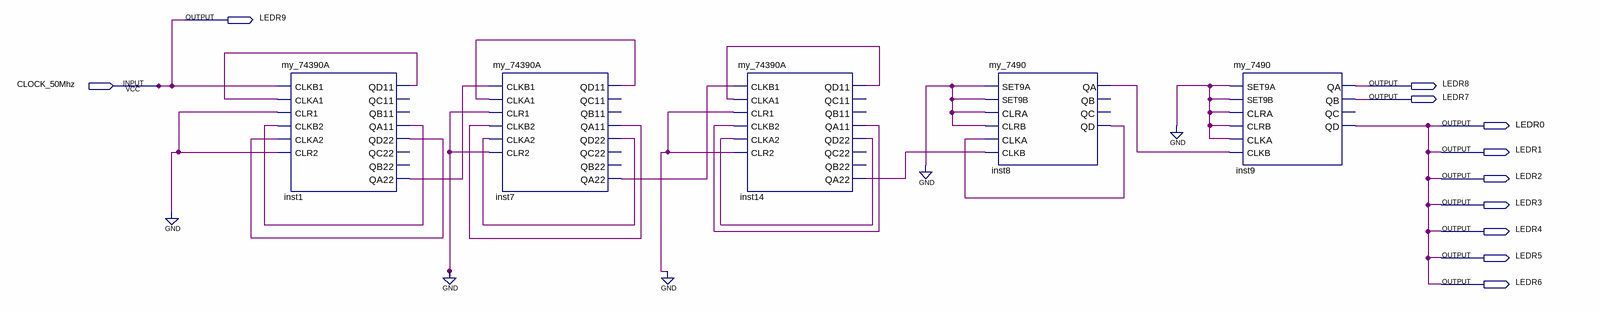
[diagram p0: schematic sheet]
// Quartus schematic DivHorlogemodif.bdf as structural Verilog: 5 symbols, 11 pins
module DivHorlogemodif (
  input  CLOCK_50Mhz,
  output LEDR9,
  output LEDR8,
  output LEDR7,
  output LEDR0,
  output LEDR1,
  output LEDR2,
  output LEDR3,
  output LEDR4,
  output LEDR5,
  output LEDR6
);

  wire inst1_qa11, inst1_qa22, inst1_qd11, inst1_qd22, inst7_qa11, inst7_qa22, inst7_qd11, inst7_qd22,
       inst8_qa, inst8_qd, inst14_qa11, inst14_qa22, inst14_qd11, inst14_qd22;

  my_74390A inst1 (
    .CLKB1(CLOCK_50Mhz), .CLKA1(inst1_qd11), .CLR1(1'b0), .CLKB2(inst1_qa11), .CLKA2(inst1_qd22),
    .CLR2(1'b0), .QD11(inst1_qd11), .QA11(inst1_qa11), .QD22(inst1_qd22), .QA22(inst1_qa22));  // open: QC11, QB11, QC22, QB22
  my_74390A inst7 (
    .CLKB1(inst1_qa22), .CLKA1(inst7_qd11), .CLR1(1'b0), .CLKB2(inst7_qa11), .CLKA2(inst7_qd22), .CLR2(1'b0),
    .QD11(inst7_qd11), .QA11(inst7_qa11), .QD22(inst7_qd22), .QA22(inst7_qa22));  // open: QC11, QB11, QC22, QB22
  my_74390A inst14 (
    .CLKB1(inst7_qa22), .CLKA1(inst14_qd11), .CLR1(1'b0), .CLKB2(inst14_qa11), .CLKA2(inst14_qd22),
    .CLR2(1'b0), .QD11(inst14_qd11), .QA11(inst14_qa11), .QD22(inst14_qd22), .QA22(inst14_qa22));  // open: QC11, QB11, QC22, QB22
  my_7490 inst8 (
    .SET9A(1'b0), .SET9B(1'b0), .CLRA(1'b0), .CLRB(1'b0), .CLKA(inst8_qd), .CLKB(inst14_qa22), .QA(inst8_qa),
    .QD(inst8_qd));  // open: QB, QC
  my_7490 inst9 (
    .SET9A(1'b0), .SET9B(1'b0), .CLRA(1'b0), .CLRB(1'b0), .CLKA(1'b0), .CLKB(inst8_qa), .QA(LEDR8),
    .QB(LEDR7), .QD(LEDR0));  // open: QC

  assign LEDR1 = LEDR0;
  assign LEDR2 = LEDR0;
  assign LEDR3 = LEDR0;
  assign LEDR4 = LEDR0;
  assign LEDR5 = LEDR0;
  assign LEDR6 = LEDR0;
  assign LEDR9 = CLOCK_50Mhz;
endmodule
